# Altium schematic sheet switch_conn.SchDoc
size A; SheetNumber: 7; SheetTotal: 7
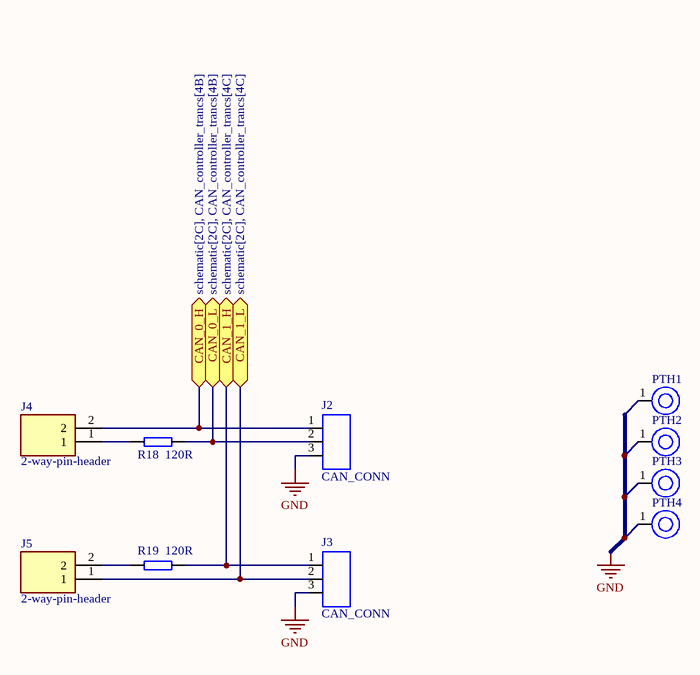
[diagram p0: switch_conn.SchDoc]

## Parts
J2  CAN_CONN  [Terminal]
J3  CAN_CONN  [Terminal]
J4  2-way-pin-header  [HDRV2W66P0X254_1X2_508X249X1067P]
J5  2-way-pin-header  [HDRV2W66P0X254_1X2_508X249X1067P]
PTH1  PTH?  [mh_fp]  (value not drawn)
PTH2  PTH?  [mh_fp]  (value not drawn)
PTH3  PTH?  [mh_fp]  (value not drawn)
PTH4  PTH?  [mh_fp]  (value not drawn)
R18  120R  [RES0402]
R19  120R  [RES0402]

## Ports
CAN_0_H (bidir, see schematic[2C], CAN_controller_trancs[4B]), CAN_0_L (bidir, see schematic[2C], CAN_controller_trancs[4B]), CAN_1_H (bidir, see schematic[2C], CAN_controller_trancs[4C]), CAN_1_L (bidir, see schematic[2C], CAN_controller_trancs[4C])

## Nets
GND: J2.3 J3.3 PTH1.1 PTH2.1 PTH3.1 PTH4.1
CAN_0_H: J2.1(CAN_H) J4.2 ; port CAN_0_H
CAN_0_L: J2.2 R18.1 ; port CAN_0_L
CAN_1_H: J3.1(CAN_H) R19.1 ; port CAN_1_H
CAN_1_L: J3.2 J5.1 ; port CAN_1_L
NetJ4_1: J4.1 R18.2
NetJ5_2: J5.2 R19.2

## Library data of the parts
PTH1-PTH4 = PTH?: Mounting Hole, 2.5mm
R18 R19 = RES 0402